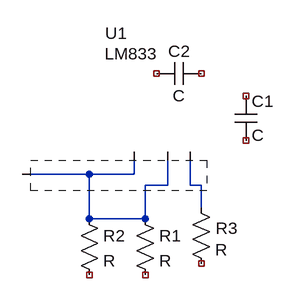
[diagram p0: schematic TP2_EJ2.asc]
TP2_EJ2.asc, the LTspice schematic file:
Version 4
SHEET 1 880 680
WIRE 224 -64 128 -64
WIRE 288 -64 288 -96
WIRE 288 -64 224 -64
WIRE 336 -48 336 -96
WIRE 336 -48 304 -48
WIRE 368 -48 368 -96
WIRE 384 -48 368 -48
WIRE 384 -16 384 -48
WIRE 224 0 224 -64
WIRE 304 0 304 -48
WIRE 304 0 224 0
SYMBOL AutoGenerated\\LM833 192 96 R0
WINDOW 0 70 -346 Bottom 2
WINDOW 3 91 -348 Top 2
SYMATTR InstName U1
SYMBOL res 288 -16 R0
SYMATTR InstName R1
SYMBOL res 208 -16 R0
SYMATTR InstName R2
SYMBOL res 368 -32 R0
WINDOW 0 37 45 Left 2
SYMATTR InstName R3
SYMBOL cap 432 -176 R0
SYMATTR InstName C1
SYMBOL cap 320 -192 R270
WINDOW 0 32 32 VTop 2
WINDOW 3 0 32 VBottom 2
SYMATTR InstName C2

The netlist it stands for:
* TP2_EJ2.asc
* U1: LM833 (symbol AutoGenerated\LM833 not available, pin order unknown); nets seen at it: N001, N002
R1 N001 NC_01 R
R2 N001 NC_02 R
R3 N002 NC_03 R
C1 NC_04 NC_05 C
C2 NC_06 NC_07 C
.backanno
.end